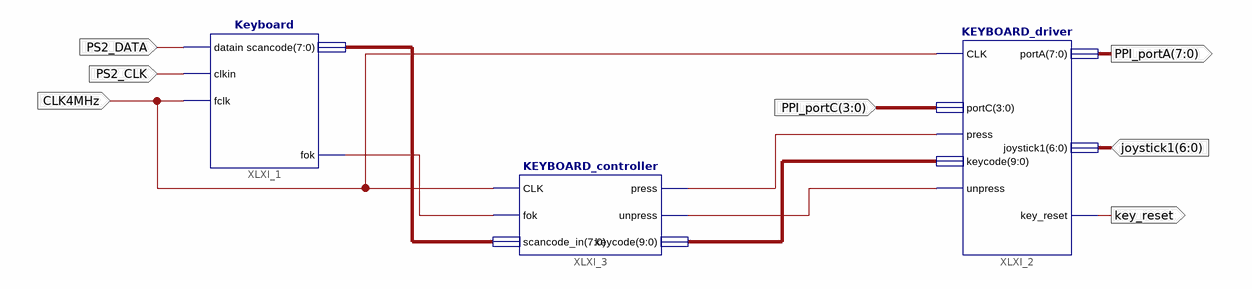
[diagram p0: schematic sheet 1]
// Xilinx ISE schematic joykeyb.sch (spartan6) as structural Verilog: 3 symbols, 7 ports
module joykeyb (
  input  PS2_CLK,
  input  PS2_DATA,
  input  CLK4MHz,
  input  [3:0] PPI_portC,
  input  [6:0] joystick1,
  output [7:0] PPI_portA,
  output key_reset
);

  wire XLXN_28, XLXN_30, XLXN_31;
  wire [7:0] XLXN_29;
  wire [9:0] XLXN_27;

  Keyboard XLXI_1 (.datain(PS2_DATA), .clkin(PS2_CLK), .fclk(CLK4MHz), .fok(XLXN_28), .scancode(XLXN_29));
  KEYBOARD_controller XLXI_3 (
    .CLK(CLK4MHz), .fok(XLXN_28), .scancode_in(XLXN_29), .press(XLXN_30), .unpress(XLXN_31), .keycode(XLXN_27));
  KEYBOARD_driver XLXI_2 (
    .CLK(CLK4MHz), .press(XLXN_30), .unpress(XLXN_31), .portC(PPI_portC), .joystick1(joystick1),
    .keycode(XLXN_27), .key_reset(key_reset), .portA(PPI_portA));
endmodule
